# EasyEDA schematic SCH_M5 GreenHat Coil Driver_2021-08-27.json

## Sheets
1 Input Logic: TITLE: GreenHat Coil Driver Board; REV: 1.0; Date: 2021-07-11; Sheet: 1/1; Drawn By: Hans R. Tanner; Company: IoTT
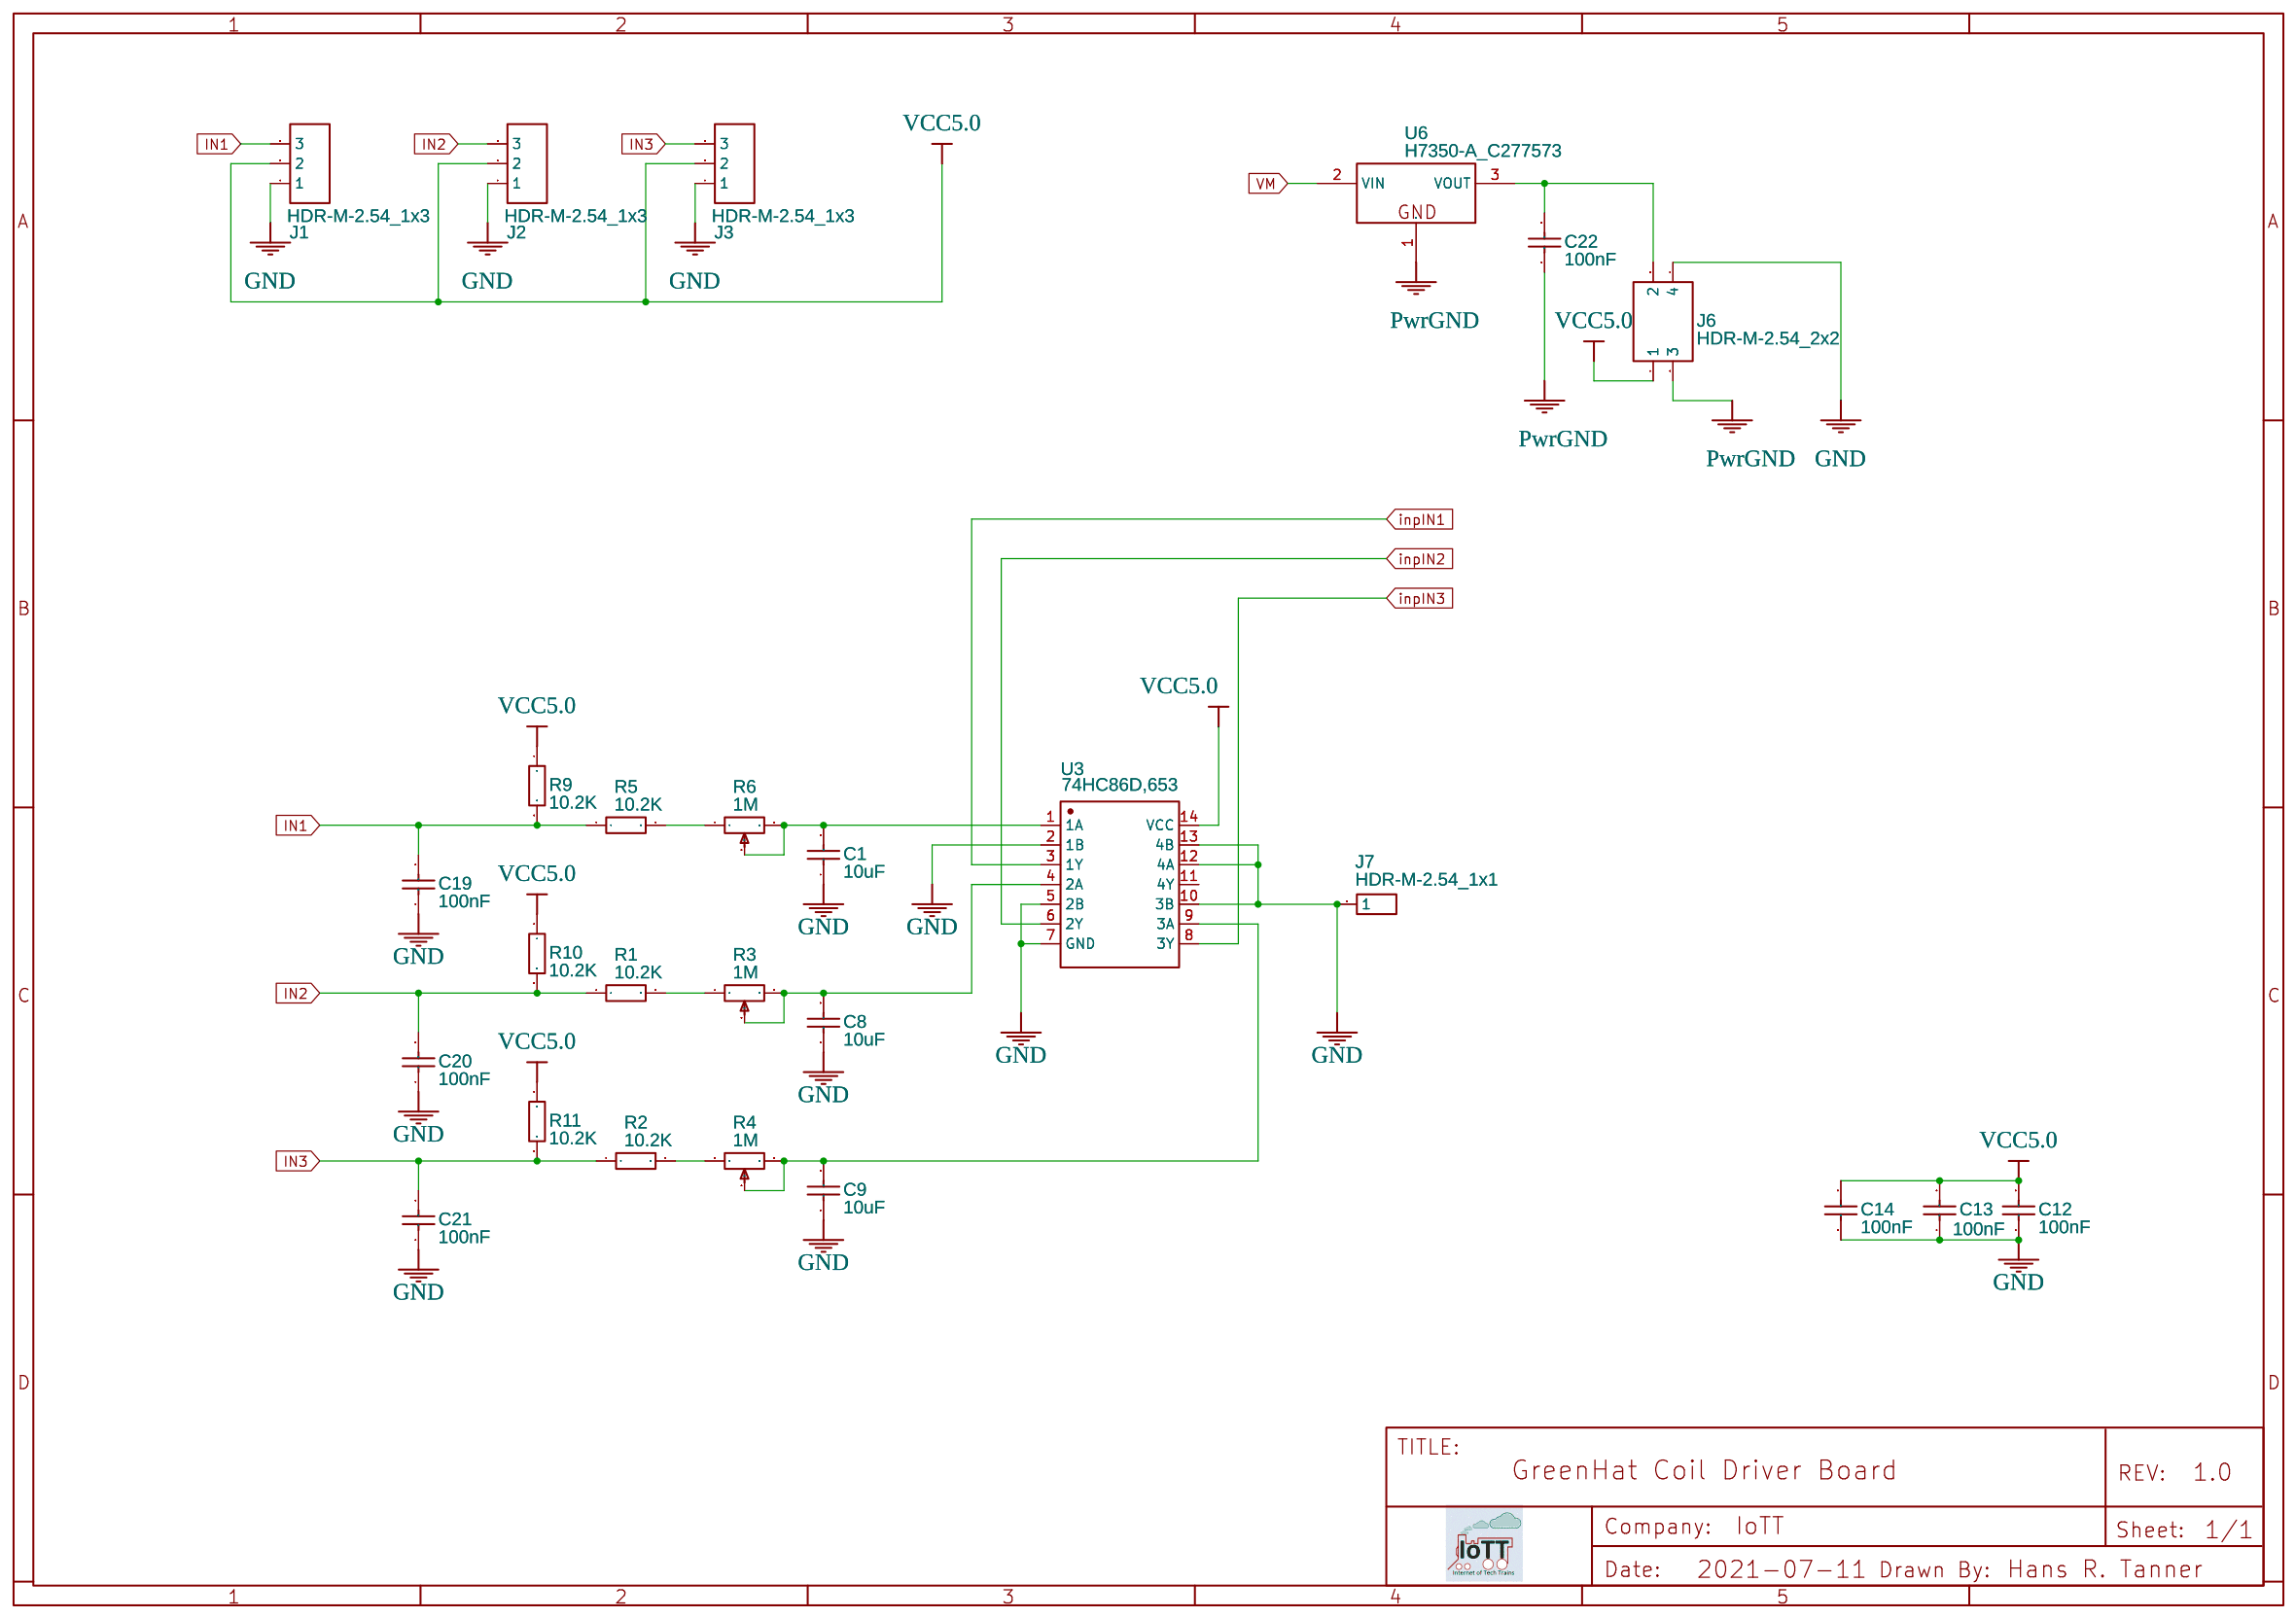
[diagram p0: Input Logic]
2 Bridge: Date: 2021-06-25
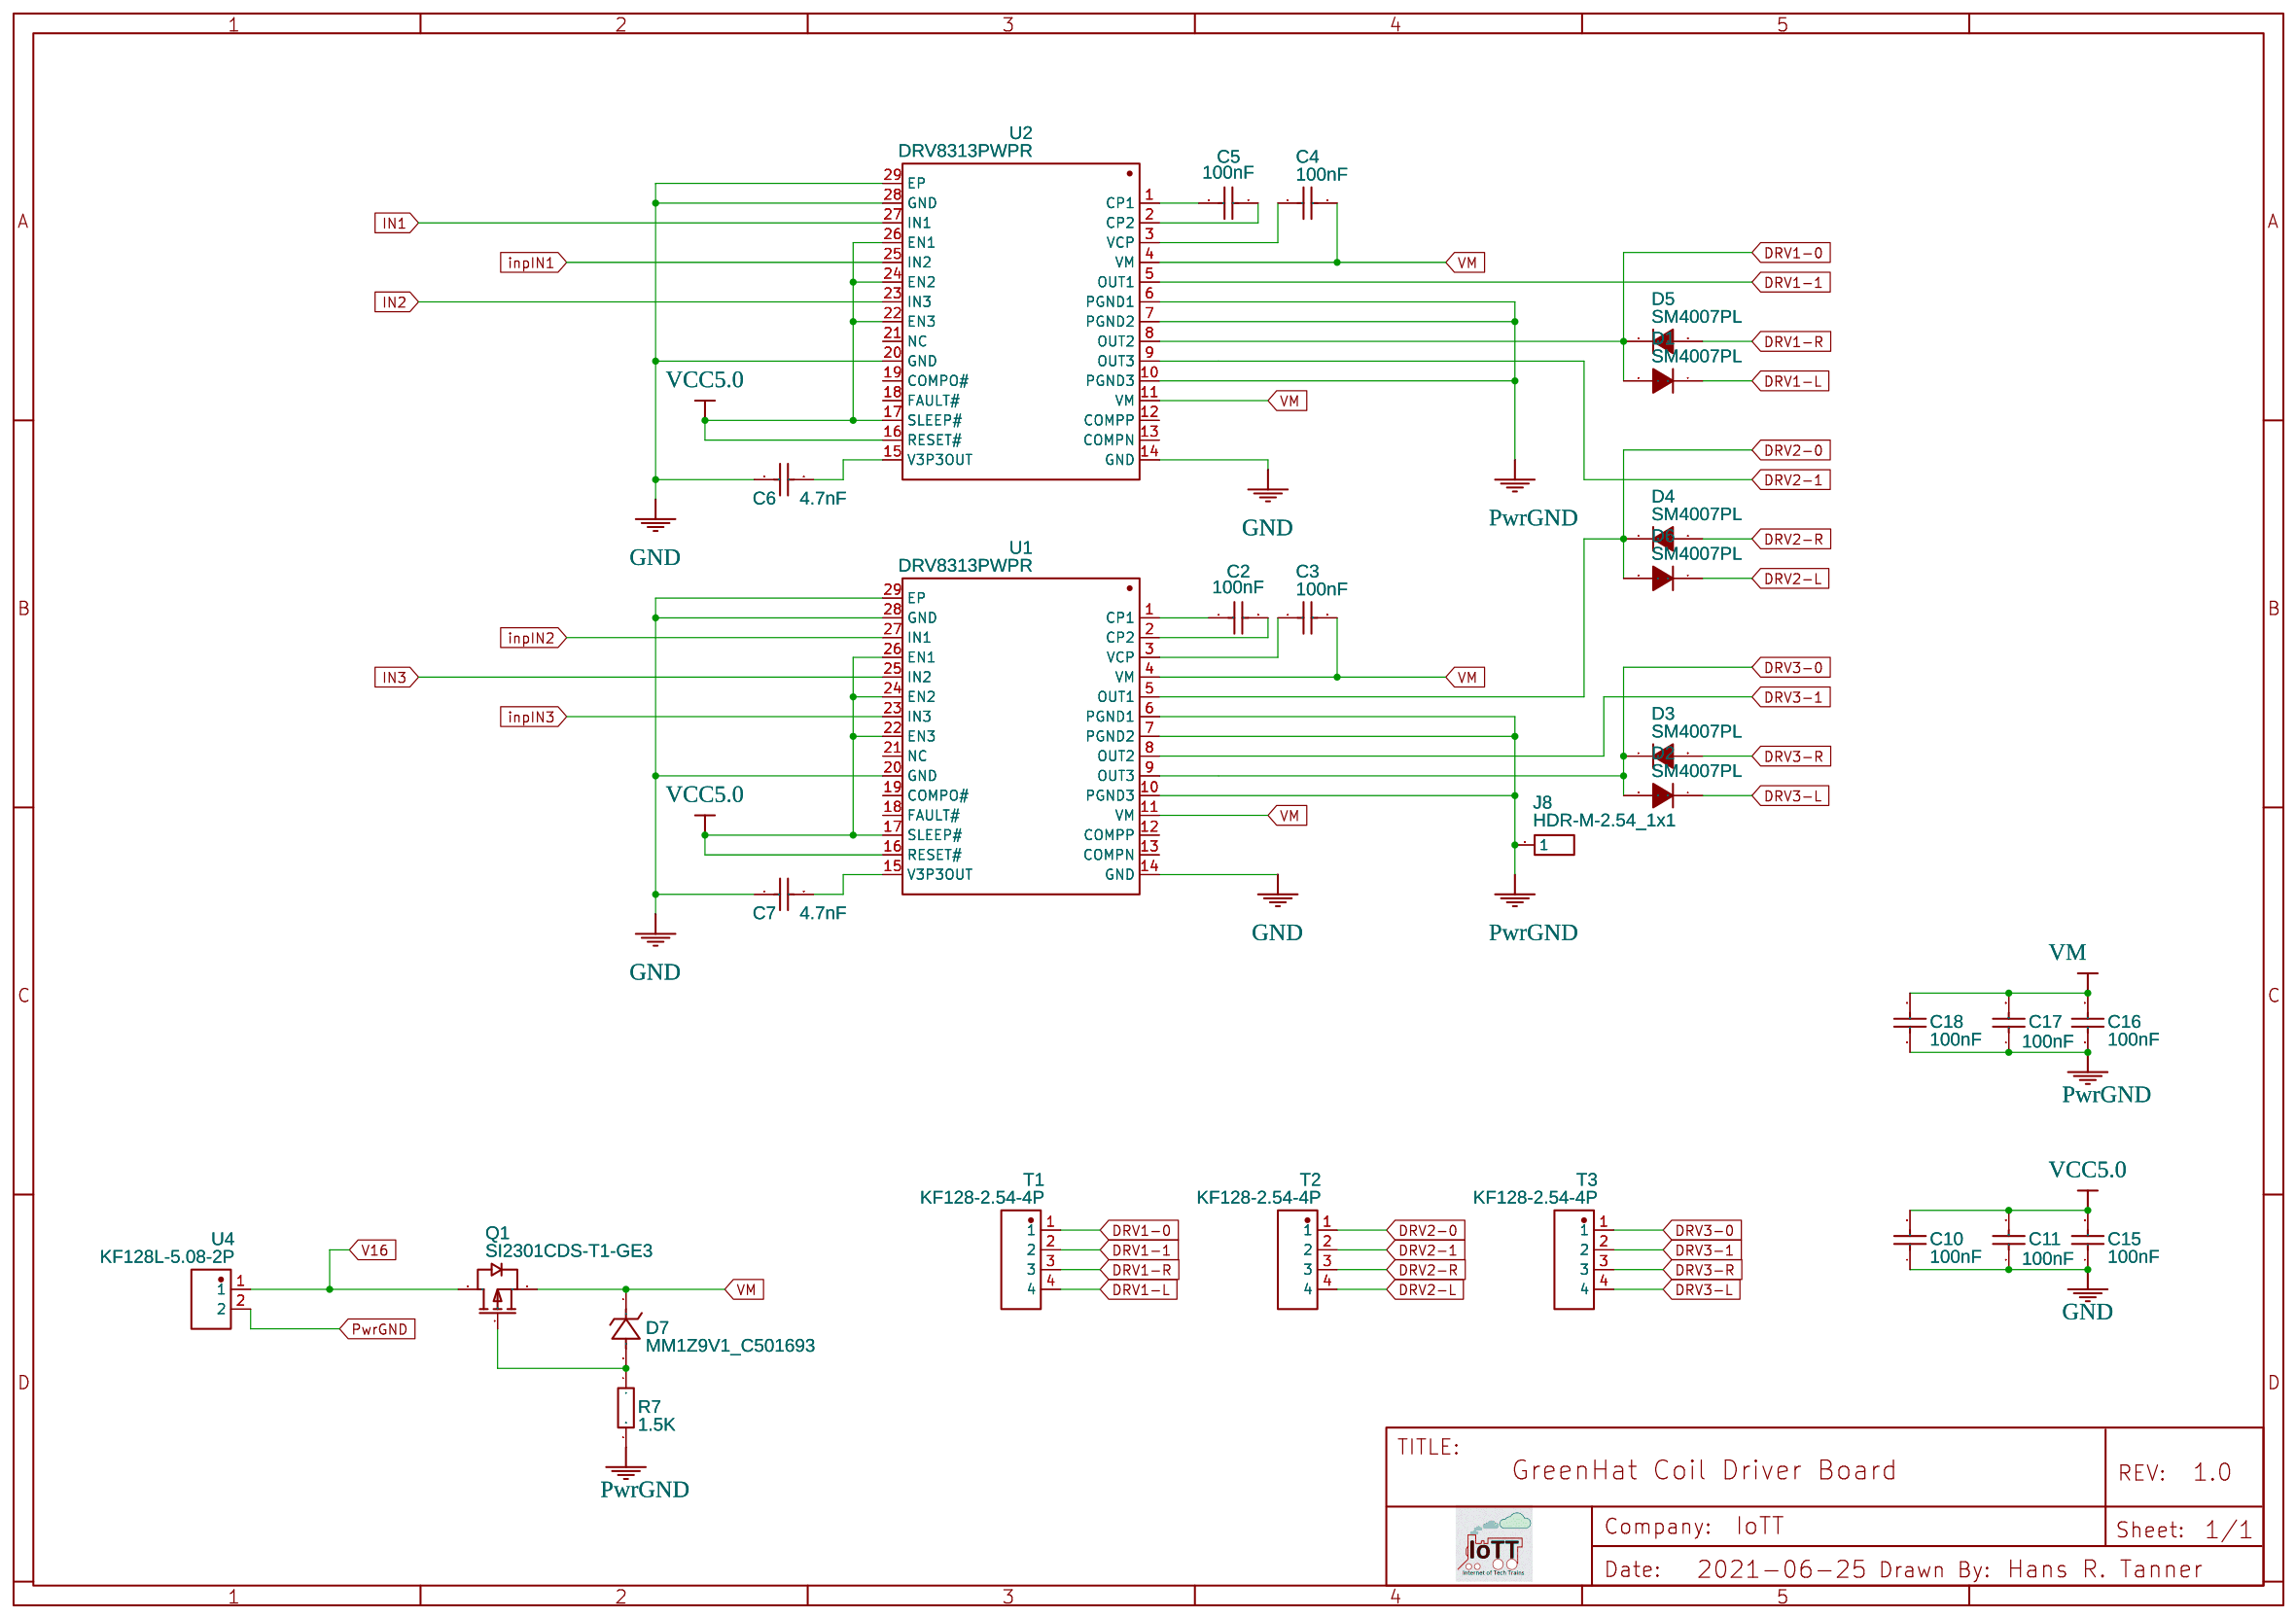
[diagram p1: Bridge]

## Parts
sheet Bridge
C2  100nF  [C0402]
C3  100nF  [C0402]
C4  100nF  [C0402]
C5  100nF  [C0402]
C6  4.7nF  [C0402]
C7  4.7nF  [C0402]
C10  100nF  [C0402]
C11  100nF  [C0402]
C15  100nF  [C0402]
C16  100nF  [C0402]
C17  100nF  [C0402]
C18  100nF  [C0402]
D1  SM4007PL  [SOD-123F_L2.8-W1.8-LS3.7-RD]
D2  SM4007PL  [SOD-123F_L2.8-W1.8-LS3.7-RD]
D3  SM4007PL  [SOD-123F_L2.8-W1.8-LS3.7-RD]
D4  SM4007PL  [SOD-123F_L2.8-W1.8-LS3.7-RD]
D5  SM4007PL  [SOD-123F_L2.8-W1.8-LS3.7-RD]
D6  SM4007PL  [SOD-123F_L2.8-W1.8-LS3.7-RD]
D7  MM1Z9V1_C501693  [SOD-123F_L2.7-W1.7-LS3.7-RD]
J8  HDR-M-2.54_1x1  [HDR-M-2.54_1X1]
Q1  SI2301CDS-T1-GE3  [SOT-23-3_L3.0-W1.7-P0.95-LS2.9-BR]
R7  1.5K  [R0402]
T1  KF128-2.54-4P  [CONN-TH_4P-P2.54_KF128-2.54-4P]
T2  KF128-2.54-4P  [CONN-TH_4P-P2.54_KF128-2.54-4P]
T3  KF128-2.54-4P  [CONN-TH_4P-P2.54_KF128-2.54-4P]
U1  DRV8313PWPR  [HTSSOP-28_L9.8-W4.5-P0.65-LS6.6-BL-EP]
U2  DRV8313PWPR  [HTSSOP-28_L9.8-W4.5-P0.65-LS6.6-BL-EP]
U4  KF128L-5.08-2P  [CONN-TH_P5.08_KF128L-5.08-2P]
sheet Input Logic
C1  10uF  [C0805]
C8  10uF  [C0805]
C9  10uF  [C0805]
C12  100nF  [C0402]
C13  100nF  [C0402]
C14  100nF  [C0402]
C19  100nF  [C0402_NEW]
C20  100nF  [C0402_NEW]
C21  100nF  [C0402_NEW]
C22  100nF  [C0402]
J1  HDR-M-2.54_1x3  [HDR-M-2.54_1X3]
J2  HDR-M-2.54_1x3  [HDR-M-2.54_1X3]
J3  HDR-M-2.54_1x3  [HDR-M-2.54_1X3]
J6  HDR-M-2.54_2x2  [HDR-M-2.54_2X2]
J7  HDR-M-2.54_1x1  [HDR-M-2.54_1X1]
R1  10.2K  [R0402]
R2  10.2K  [R0402]
R3  1M  [RES-ADJ-TH_3P-L9.5-W9.5-P2.50-L_3386P]
R4  1M  [RES-ADJ-TH_3P-L9.5-W9.5-P2.50-L_3386P]
R5  10.2K  [R0402]
R6  1M  [RES-ADJ-TH_3P-L9.5-W9.5-P2.50-L_3386P]
R9  10.2K  [R0402]
R10  10.2K  [R0402]
R11  10.2K  [R0402]
U3  74HC86D,653  [SOIC-14_L8.7-W3.9-P1.27-LS6.0-BL]
U6  H7350-A_C277573  [SOT-89-3_L4.5-W2.5-P1.50-LS4.2-BR]

## Library data of the parts
C2-C5 C10-C18 C22 = CL05B104KO5NNNC: Supplier: LCSC; Manufacturer: SAMSUNG; LCSC Assembly: Yes; Supplier Part: C1525; SMT Type: Basic
C6 C7 = 0402B472K500NT: Supplier: LCSC; Manufacturer: FH; LCSC Assembly: Yes; Supplier Part: C1538; SMT Type: Basic
D1-D6 = SM4007PL: Supplier: LCSC; Manufacturer: MDD; image: //image.lceda.cn/szlcsc/C64898.jpg; Supplier Part: C64898; LCSC Assembly: Yes; SMT Type: Basic
D7 = MM1Z9V1_C501693: Supplier: LCSC; Supplier Part: C501693; Manufacturer: JF; Manufacturer Part: MM1Z9V1; Contributor: LCSC; JLCPCB Part Class: Extended Part
J7 J8 = HDR-M-2.54_1x1: Supplier Part: C81276; Supplier: LCSC; Contributor: LCEDA_Lib
Q1 = SI2301CDS-T1-GE3: Supplier: LCSC; Manufacturer: VISHAY; LCSC Assembly: Yes; image: //image.lceda.cn/szlcsc/C10487.jpg; Supplier Part: C10487; SMT Type: Basic
R7 = 0402WGF1501TCE: Supplier: LCSC; Manufacturer: UniOhm; LCSC Assembly: Yes; Supplier Part: C25867; SMT Type: Basic
T1-T3 = KF128-2.54-4P: Supplier: LCSC; Supplier Part: C474922; Manufacturer: Cixi Kefa Elec; Contributor: LCSC; JLCPCB Part Class: Extended Part
U1 U2 = DRV8313PWPR: Supplier: LCSC; Supplier Part: C92482; Manufacturer: Texas Instruments; Contributor: LCSC; LCSC Assembly: Yes; SMT Type: Extend
U4 = KF128L-5.08-2P: Supplier: LCSC; Supplier Part: C474940; Manufacturer: Cixi Kefa Elec; Contributor: LCSC
C1 C8 C9 = CL21A106KAYNNNE: Supplier: LCSC; Manufacturer: SAMSUNG; LCSC Assembly: Yes; Supplier Part: C15850; SMT Type: Basic
C19-C21 = CL05B104KO5NNNC: Supplier: LCSC; Manufacturer: SAMSUNG; Supplier Part: C1525; JLCPCB Part Class: Basic Part
J1-J3 = HDR-M-2.54_1x3: Supplier Part: C180248; Supplier: LCSC; Contributor: LCEDA_Lib
J6 = HDR-M-2.54_2x2: Supplier Part: C66690; Supplier: LCSC; Contributor: LCEDA_Lib
R1 R2 R5 R9-R11 = RTT021022FTH: Supplier: LCSC; Manufacturer: RALEC; Supplier Part: C102756; JLCPCB Part Class: Extended Part
R3 R4 R6 = 3386P-1-105_C118946: Supplier: LCSC; Supplier Part: C118946; Manufacturer: Chengdu Guosheng Tech; Manufacturer Part: 3386P-1-105; Contributor: LCSC; JLCPCB Part Class: Extended Part
U3 = 74HC86D,653: Supplier: LCSC; Manufacturer: Nexperia; image: //image.lceda.cn/szlcsc/C5955.jpg; Supplier Part: C5955; LCSC Assembly: Yes; SMT Type: Extend
U6 = H7350-A_C277573: Supplier: LCSC; Supplier Part: C277573; Manufacturer: Shanghai Siproin Microelectronics; Manufacturer Part: H7350-A; Contributor: LCSC; JLCPCB Part Class: Extended Part

## Nets
GND: C1.1 C6.1 C7.1 C8.1 C9.1 C10.1 C11.1 C12.1 C13.1 C14.1 C15.1 C19.1 C20.1 C21.1 J1.1 J2.1 J3.1 J6.4 J7.1 U1.14(GND) U1.20(GND) U1.28(GND) U1.29(EP) U2.14(GND) U2.20(GND) U2.28(GND) U2.29(EP) U3.2(1B) U3.5(2B) U3.7(GND) U3.10(3B) U3.12(4A) U3.13(4B)
V16: Q1.3(D) U4.1
VCC5.0: C10.2 C11.2 C12.2 C13.2 C14.2 C15.2 J1.2 J2.2 J3.2 J6.1 R9.1 R10.1 R11.1 U1.16(RESET#) U1.17(SLEEP#) U1.22(EN3) U1.24(EN2) U1.26(EN1) U2.16(RESET#) U2.17(SLEEP#) U2.22(EN3) U2.24(EN2) U2.26(EN1) U3.14(VCC)
DRV1-0: D1.2(A) D5.1(C) T1.1 U2.8(OUT2)
DRV1-1: T1.2 U2.5(OUT1)
DRV1-L: D1.1(C) T1.4
DRV1-R: D5.2(A) T1.3
DRV2-0: D4.1(C) D6.2(A) T2.1 U1.5(OUT1)
DRV2-1: T2.2 U2.9(OUT3)
DRV2-L: D6.1(C) T2.4
DRV2-R: D4.2(A) T2.3
DRV3-0: D2.2(A) D3.1(C) T3.1 U1.9(OUT3)
DRV3-1: T3.2 U1.8(OUT2)
DRV3-L: D2.1(C) T3.4
DRV3-R: D3.2(A) T3.3
IN1: C19.2 J1.3 R5.1 R9.2 U2.27(IN1)
IN2: C20.2 J2.3 R1.1 R10.2 U2.23(IN3)
IN3: C21.2 J3.3 R2.1 R11.2 U1.25(IN2)
inpIN1: U2.25(IN2) U3.3(1Y)
inpIN2: U1.27(IN1) U3.6(2Y)
inpIN3: U1.23(IN3) U3.8(3Y)
PwrGND: C16.1 C17.1 C18.1 C22.1 J6.3 J8.1 R7.2 U1.6(PGND1) U1.7(PGND2) U1.10(PGND3) U2.6(PGND1) U2.7(PGND2) U2.10(PGND3) U4.2 U6.1(GND)
VM: C3.2 C4.2 C16.2 C17.2 C18.2 D7.1(K) Q1.2(S) U1.4(VM) U1.11(VM) U2.4(VM) U2.11(VM) U6.2(VIN)
Net-(C1-2): C1.2 R6.2 R6.3 U3.1(1A)
Net-(C2-1): C2.1 U1.1(CP1)
Net-(C2-2): C2.2 U1.2(CP2)
Net-(C3-1): C3.1 U1.3(VCP)
Net-(C4-1): C4.1 U2.3(VCP)
Net-(C5-1): C5.1 U2.1(CP1)
Net-(C5-2): C5.2 U2.2(CP2)
Net-(C6-2): C6.2 U2.15(V3P3OUT)
Net-(C7-2): C7.2 U1.15(V3P3OUT)
Net-(C8-2): C8.2 R3.2 R3.3 U3.4(2A)
Net-(C9-2): C9.2 R4.2 R4.3 U3.9(3A)
Net-(C22-2): C22.2 J6.2 U6.3(VOUT)
Net-(D7-2): D7.2(A) Q1.1(G) R7.1
Net-(R1-2): R1.2 R3.1
Net-(R2-2): R2.2 R4.1
Net-(R5-2): R5.2 R6.1

Not connected (* = marked no-connect by the designer): U1 12(COMPP) 13(COMPN) 18(FAULT#) 19(COMPO#) 21(NC); U2 12(COMPP) 13(COMPN) 18(FAULT#) 19(COMPO#) 21(NC); U3 11(4Y)
